# Altium schematic sheet SoM - PullUp PullDown.SchDoc
size 420 x 297 mm; SheetNumber: 3; SheetTotal: 7
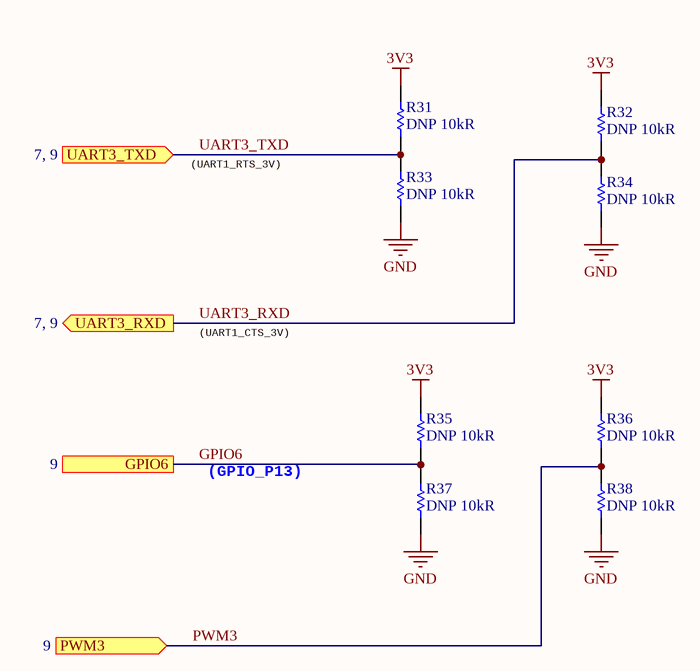
[diagram p0: SoM - PullUp PullDown.SchDoc]

## Parts
R31  DNP 10kR  [RESC2013X60X35NL10T20]
R32  DNP 10kR  [RESC2013X60X35NL10T20]
R33  DNP 10kR  [RESC2013X60X35NL10T20]
R34  DNP 10kR  [RESC2013X60X35NL10T20]
R35  DNP 10kR  [RESC2013X60X35NL10T20]
R36  DNP 10kR  [RESC2013X60X35NL10T20]
R37  DNP 10kR  [RESC2013X60X35NL10T20]
R38  DNP 10kR  [RESC2013X60X35NL10T20]

## Ports
GPIO6 (see 9), PWM3 (in, see 9), UART3_RXD (out, see 7, 9), UART3_TXD (in, see 7, 9)

## Nets
3V3: R31.1 R32.1 R35.1 R36.1
GND: R33.2 R34.2 R37.2 R38.2
GPIO6: R35.2 R37.1 ; port GPIO6
PWM3: R36.2 R38.1 ; port PWM3
UART3_RXD: R32.2 R34.1 ; port UART3_RXD
UART3_TXD: R31.2 R33.1 ; port UART3_TXD

## Notes on the sheet
- (UART1_RTS_3V)
- (UART1_CTS_3V)
- (GPIO_P13)
- THIS DOCUMENT AND THE DATA DISCLOSED HEREIN OR
- HEREWITH IS THE PROPERTY OF ALTIUM LIMITED AND MAY
- DWG NO:
- REVISION
- REV:
- DESCRIPTION
- DATE
- APPROVED
- BE FREELY DISTRIBUTED IN WHOLE. NO RIGHTS ARE
- RESERVED OR EXPRESS OR IMPLIED WARANTEE GIVEN.
- ENG:
- APPROVALS
- PROJECT
- DSN:
- CHK:
- REFERENCE DOCUMENTS
- PROJECT REVISION:
- TITLE
- DOCUMENT REVISION:
- DESIGN ITEM:
- BOM:
- FAB DWG:
- PCB DWG:
- ASSY DWG:
- SCALE:
- A3
- SIZE
- CAGE CODE
- FILE NAME
- DWG NO.
- SHEET
- OF
- REV

## Library data of the parts
R31-R38 = CMP-1659-00013-4: RC0805FR-0710KL Chip Resistor, 10 KOhm, +/- 1%, 0.125 W, -55 to 155 degC, 0805 (2012 Metric), RoHS, Tape and Reel; Manufacturer: Yageo; Voltage Rating: 150 V; Mount: Surface Mount; ComponentLink1Description: Manufacturer URL; ComponentLink2URL: http://www.yageo.com/documents/recent/PYu-RC_Group_51_RoHS_L_04.pdf; Pins: 2; Length: 2 mm; Min Operating Temperature: -55 degC; Height: 0.5 mm; Mounting Technology: Surface Mount; RoHSCompliant: true; REACH SVHC: No SVHC; ComponentLink1URL: http://www.yageo.com/; Max Operating Temperature: 155 degC; PackageReference: 0805; DatasheetVersion: Rev. 4, 02/2016; Package Quantity: 5000; Packaging: Tape and Reel; ComponentLink2Description: Datasheet; PackageDescription: 2-Pin Surface Mounted Device, Body 2 x 1.25 mm